# EAGLE design i2cstump-usbc (EAGLE 9.2.2)
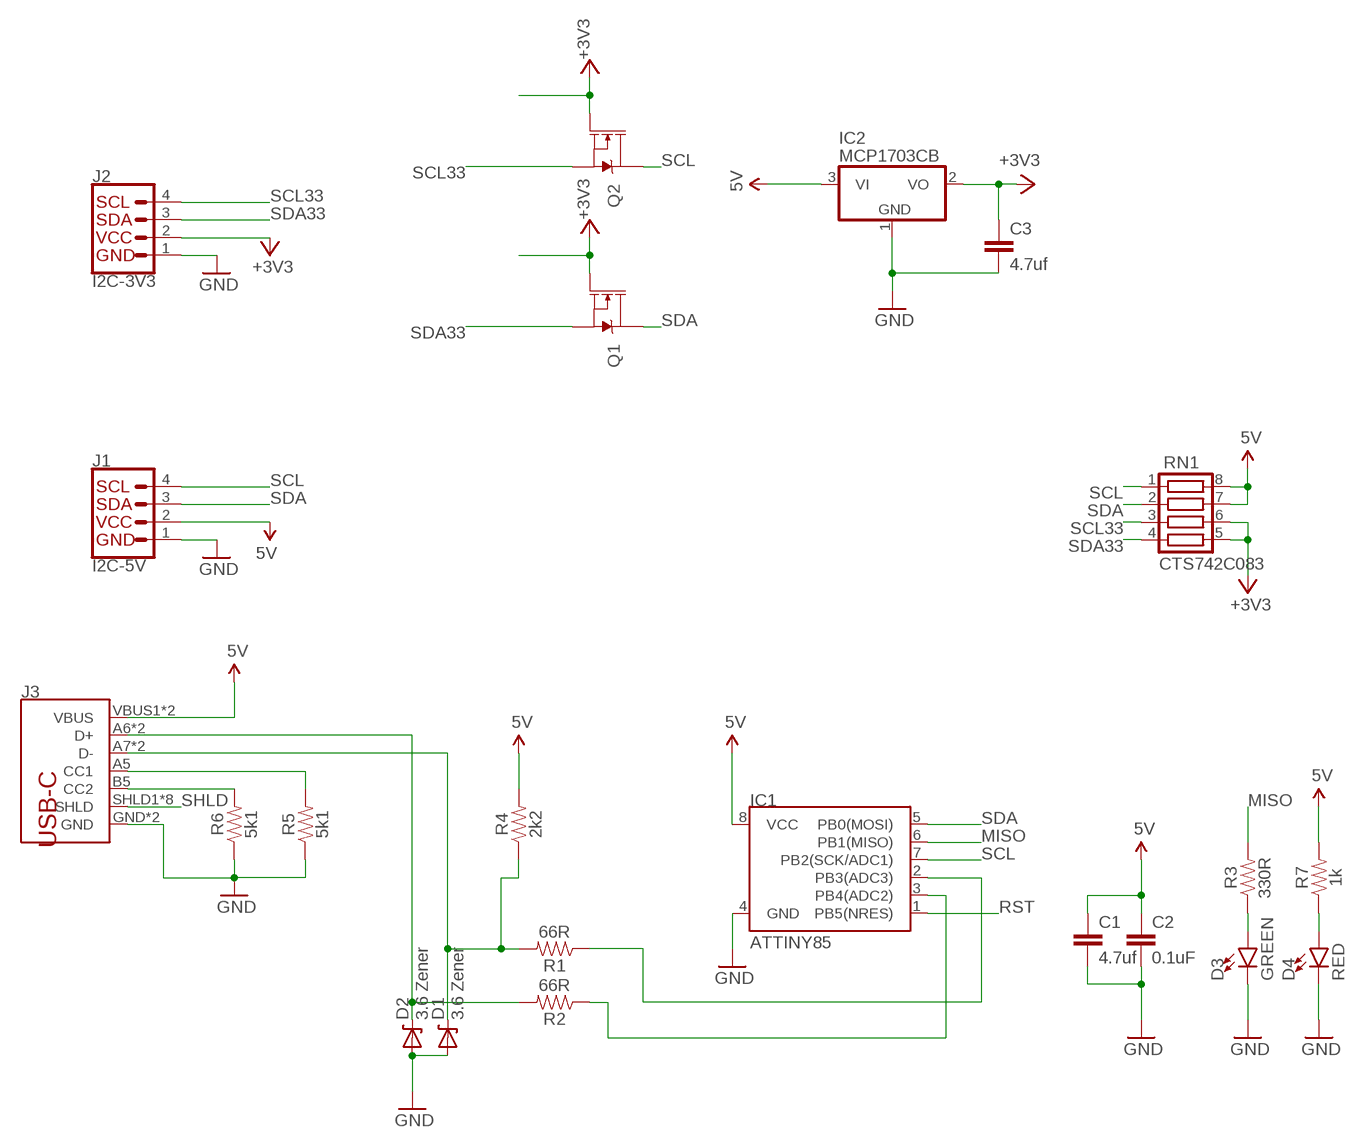
[diagram p0: schematic, sheet 1]

## Parts
C1  4.7uf  CAP0805  [0805]
C2  0.1uF  0.1UF-0603-25V-(+80/-20%)  [0603]
C3  4.7uf  CAP0805  [0805]
D1  3.6 Zener  DIODE-ZENER-BZT52  [SOD-323]
D2  3.6 Zener  DIODE-ZENER-BZT52  [SOD-323]
D3  GREEN  LED-GREEN0603  [LED-0603]
D4  RED  LED-GREEN0603  [LED-0603]
IC1  ATTINY85  ATTINY45  [SO08-EIAJ]
IC2  MCP1703CB  [SOT23]
J1  I2C-5V  QWIIC_CONNECTORJS-1MM  [1X04_1MM_RA]
J2  I2C-3V3  QWIIC_CONNECTORJS-1MM  [1X04_1MM_RA]
J3  USB_C16PIN  [USB-C-16P]
Q1  220mA/50V/3.5Ω  MOSFET-NCH-BSS138  [SOT23-3]
Q2  220mA/50V/3.5Ω  MOSFET-NCH-BSS138  [SOT23-3]
R1  66R  RESISTOR0603  [0603]
R2  66R  RESISTOR0603  [0603]
R3  330R  RESISTOR0603  [0603]
R4  2k2  RESISTOR0603  [0603]
R5  5k1  RESISTOR0603  [0603]
R6  5k1  RESISTOR0603  [0603]
R7  1k  RESISTOR0603  [0603]
RN1  CTS742C083  [CTS742C083]

## Nets
5V: C1.1 C2.1 IC1.8(VCC) IC2.3(VI) J1.2(VCC) J3.VBUS1(VBUS) J3.VBUS2(VBUS) R4.2 R7.2 RN1.7 RN1.8
+3V3: C3.1 IC2.2(VO) J2.2(VCC) Q1.1(G) Q2.1(G) RN1.5 RN1.6
GND: C1.2 C2.2 C3.2 D1.2(A) D2.2(A) D3.C D4.C IC1.4(GND) IC2.1(GND) J1.1(GND) J2.1(GND) J3.GND J3.GND2(GND) R5.1 R6.1
MISO: IC1.6(PB1(MISO)) R3.2
N$1: IC1.2(PB3(ADC3)) R1.1
N$2: D3.A R3.1
N$3: D4.A R7.1
N$4: J3.A5(CC1) R5.2
N$5: J3.B5(CC2) R6.2
N$6: IC1.3(PB4(ADC2)) R2.1
RST: IC1.1(PB5(NRES))
SCL: IC1.7(PB2(SCK/ADC1)) J1.4(SCL) Q2.3(D) RN1.1
SCL33: J2.4(SCL) Q2.2(S) RN1.3
SDA: IC1.5(PB0(MOSI)) J1.3(SDA) Q1.3(D) RN1.2
SDA33: J2.3(SDA) Q1.2(S) RN1.4
SHLD: J3.SHLD1(SHLD) J3.SHLD2(SHLD) J3.SHLD3(SHLD) J3.SHLD4(SHLD) J3.SHLD5(SHLD) J3.SHLD6(SHLD) J3.SHLD7(SHLD) J3.SHLD8(SHLD)
USB_M: D1.1(C) J3.A7(D-) J3.B7(D-) R1.2 R4.1
USB_P: D2.1(C) J3.A6(D+) J3.B6(D+) R2.2

## Library data of the parts
C1 C3 = SparkFun:CAP: Capacitor Standard 0603 ceramic capacitor, and 0.1" leaded capacitor.
C2 = SparkFun-Capacitors:0.1UF: 0.1µF ceramic capacitors A capacitor is a passive two-terminal electrical component used to store electrical energy temporarily in an electric field.; PROD_ID: CAP-00810
D1 D2 = SparkFun:DIODE-ZENER: Zener Diode Production Part - 8199 3.4V Zener Voltage
D3 = SparkFun-LED:LED-GREEN: Green SMD LED Used in manufacturing of various products at SparkFun Packages: 0603 - SMD 0603 package [Product Link] <http://www.futureelectronics.com/en/technologies/semiconductors/optoelectronics/leds/Pages/9894312-LTST-C190GKT.aspx?CrossPart=HSMG-C190&IM=0> LilyPad 1206 - SMD1206 LilyPad package [Product Link] <http://www.futureelectronics.com/en/Technologies/Product.aspx?ProductID=IN150NGHARVATEKCORPORATION2049943&IM=0> 1206 - SMD1206 package [Product Link] <http://www.futureelectronics.com/en/technologies/semiconductors/optoelectronics/leds/Pages/8315665-LTST-C150KGKT.aspx?IM=0> 1206 Bottom Mount -SMD 1206 Bottom Mount [Product Link] <http://www.digikey.com/product-detail/en/lite-on-inc/LTST-C230KGKT/160-1456-1-ND/386854> SparkFun Products: Pro Mini 328 -5V <https://www.sparkfun.com/products/821> RedBoard <https://www.sparkfun.com/products/12757> MP3 Trigger <https://www.sparkfun.com/products/13720> Makey Makey <https://www.sparkfun.com/products/11076>; PROD_ID: DIO-00821
D4 = SparkFun-LED:LED-GREEN: Green SMD LED Used in manufacturing of various products at SparkFun Packages: 0603 - SMD 0603 package [Product Link] <http://www.futureelectronics.com/en/technologies/semiconductors/optoelectronics/leds/Pages/9894312-LTST-C190GKT.aspx?CrossPart=HSMG-C190&IM=0> LilyPad 1206 - SMD1206 LilyPad package [Product Link] <http://www.futureelectronics.com/en/Technologies/Product.aspx?ProductID=IN150NGHARVATEKCORPORATION2049943&IM=0> 1206 - SMD1206 package [Product Link] <http://www.futureelectronics.com/en/technologies/semiconductors/optoelectronics/leds/Pages/8315665-LTST-C150KGKT.aspx?IM=0> 1206 Bottom Mount -SMD 1206 Bottom Mount [Product Link] <http://www.digikey.com/product-detail/en/lite-on-inc/LTST-C230KGKT/160-1456-1-ND/386854> SparkFun Products: Pro Mini 328 -5V <https://www.sparkfun.com/products/821> RedBoard <https://www.sparkfun.com/products/12757> MP3 Trigger <https://www.sparkfun.com/products/13720> Makey Makey <https://www.sparkfun.com/products/11076>; PROD_ID: DIO-00821; VALUE: GREEN
IC1 = SparkFun:ATTINY45: Atmel ATTiny45
IC2 = linear:MCP1703: 250 mA, 16V, Low Quiescent Current LDO Regulator Source: http://ww1.microchip.com/downloads/en/DeviceDoc/22049b.pdf
J1 J2 = SparkFun-Connectors:QWIIC_CONNECTOR: SparkFun I2C Standard Qwiic Connector An SMD 1mm pitch JST connector makes it easy and quick (get it? Qwiic?) to connect I2C devices to each other. The Qwiic system <http://www.sparkfun.com/qwiic> enables fast and solderless connection between popular platforms and various sensors and actuators. We carry 200mm <https://www.sparkfun.com/products/14204>, 100mm <https://www.sparkfun.com/products/14205>, 50mm <https://www.sparkfun.com/products/14206>, and breadboard friendly <https://www.sparkfun.com/products/14207> Qwiic cables. We also offer 10 pcs strips <https://www.sparkfun.com/products/14323> the SMD connectors.
J3 = USB-C:USB_C: USB Type C 16Pin Connector Super Speed pins not available on the 16-pin purely SMD connector so this part is best for USB 2.0 implementations. D1 and D2 are tied together enabling D+/- no matter which way the cable is plugged into the connector. The two channel configuration pins (CC1/2) are exposed. These are normally connected to ground via 5.1k resistors but can be reconfigured for high current/high power applications.; PROD_ID: CONN-14122
Q1 Q2 = SparkFun-DiscreteSemi:MOSFET-NCH: N-channel MOSFETs Voltage controlled devices that allow control of high current outputs. SparkFun Products: SparkFun OpenScale <https://www.sparkfun.com/products/13261> SparkFun Digital Sandbox <https://www.sparkfun.com/products/12651> SparkFun Monster Moto Shield <https://www.sparkfun.com/products/10182> SparkFun MOSFET Power Controller <https://www.sparkfun.com/products/11214>; PROD_ID: TRANS-00830
R1-R7 = SparkFun-Resistors:RESISTOR: Generic Resistor Package
RN1 = resistor-net:CTS742C083: Chip Resistor Array 4 Single Resistor Source: http://www.ctscorp.com/components/Datasheets/CTSChipArrayDs.pdf; OC_FARNELL: unknown; OC_NEWARK: unknown

## Board
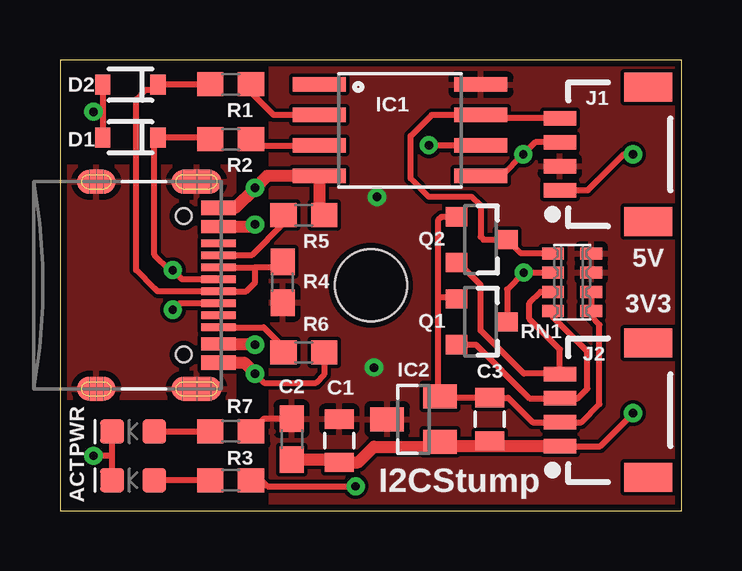
[diagram p1: board, top side]
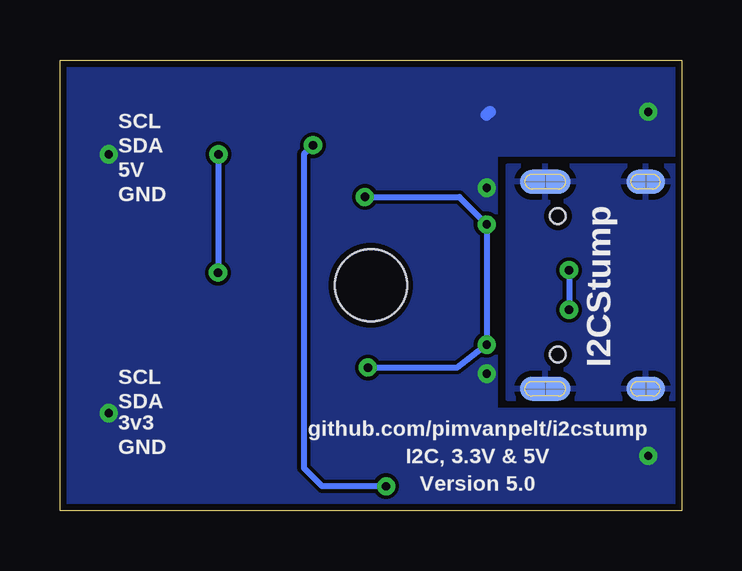
[diagram p2: board, bottom side, seen from below]

Size 25.91 x 18.8 mm. Coordinates in mm from the lower left corner, seen from the top.
Outline: 0,0 25.91,0 25.91,18.8 0,18.8 0,0
Copper layers (1*16): Top 0.035mm / dielectric 1.5mm / Bottom 0.035mm
Design rules "default *": minimum track width 6mil, minimum drill 0.35mm, track to track 6mil, track to pad 6mil, pad to pad 6mil, via to via 6mil, smd to smd 6mil, copper to edge 10mil, drill to drill 6mil, minimum pad ring 10mil, minimum via ring 8mil, stop-mask expansion 4mil, vias tented up to drill 20mil, thermal gap 10mil
Holes 3 mm at 12.95,9.4

### Footprints (pad centres in the part's own frame; a part is rotated, then mirrored left to right if it is on the bottom)
0805 = smd 0.8 x 1.2: 1 -0.9,0; 2 0.9,0
0603 = smd 1.1 x 1: 1 -0.85,0; 2 0.85,0
SOD-323 = smd 0.63 x 0.83: 1 -1.15,0; 2 1.15,0
LED-0603 = smd 1 x 1: A -0.877,0; C 0.877,0
SO08-EIAJ = smd 0.61 x 2.21: 1 -1.905,-3.378; 2 -0.635,-3.378; 3 0.635,-3.378; 4 1.905,-3.378; 5 1.905,3.353; 6 0.635,3.353; 7 -0.635,3.353; 8 -1.905,3.353
SOT23 = smd 1 x 1.4: 1 -0.95,-1.1; 2 0.95,-1.1; 3 0,1.1
1X04_1MM_RA = smd 0.6 x 1.35: 1 -1.5,0; 2 -0.5,0; 3 0.5,0; 4 1.5,0 | smd 1.2 x 2: NC1 2.8,-3.675; NC2 -2.8,-3.675
USB-C-16P = smd 0.3 x 1.45: A5 -1.25,0; A6 -0.25,0; A7 0.25,0; A8 1.25,0; B5 1.75,0; B6 0.75,0; B7 -0.75,0; B8 -1.75,0 | smd 0.6 x 1.45: GND -3.225,0; GND2 3.225,0 | smd 1 x 2.1: SHLD1 -4.32,-0.915; SHLD2 4.32,-0.915 | smd 1 x 2.1 bottom: SHLD3 -4.32,-0.915; SHLD4 4.32,-0.915 | smd 1 x 1.6: SHLD5 -4.32,-5.095; SHLD8 4.32,-5.095 | smd 1 x 1.6 bottom: SHLD6 -4.32,-5.095; SHLD7 4.32,-5.095 | smd 0.55 x 1.45: VBUS1 -2.45,0; VBUS2 2.45,0 | hole 0.65: -2.89,-1.445; 2.89,-1.445
SOT23-3 = smd 0.8 x 0.9: 1 -0.95,-1; 2 0.95,-1; 3 0,1.1
CTS742C083 = smd 0.5 x 0.9: 1 -1.2,-0.8; 2 -0.4,-0.8; 3 0.4,-0.8; 4 1.2,-0.8; 5 1.2,0.8; 6 0.4,0.8; 7 -0.4,0.8; 8 -1.2,0.8

### Placement (x,y rotation side)
C1  11.64,2.92 270 top
C2  9.65,2.98 270 top
C3  17.91,3.81 270 top
D1  2.93,17.76 180 top
D2  2.93,15.56 180 top
D3  3.05,1.27 180 top
D4  3.05,3.3 180 top
IC1  14.18,15.86 270 top
IC2  14.73,3.81 90 top
J1  20.83,14.86 90 top
J2  20.83,4.19 90 top
J3  6.6,9.4 270 top
Q1  17.53,7.87 270 top
Q2  17.53,11.3 270 top
R1  7.11,17.78 180 top
R2  7.11,15.49 180 top
R3  7.11,1.27 0 top
R4  9.27,9.53 270 top
R5  10.16,12.32 180 top
R6  10.16,6.6 180 top
R7  7.11,3.3 0 top
RN1  21.34,9.53 270 top

### Tracks (layer width: path | path; a pad name or v marks a point on that pad's centre or on a via)
5V  (via drill 0.35)
  Top 0.254: C2.1 8.49,3.83 R7.2
  Top 0.508: J3.VBUS1 8.04,11.85 v8.13,11.94 | J3.VBUS2 8.1,6.95 v8.13,6.92
  Bottom 0.254: v13.08,5.97 9.37,5.97 v8.13,6.92 v8.13,11.94 9.27,13.08 v13.21,13.08
  pour Top: 8.76,18.8 25.91,18.8 25.91,0 8.76,0
+3V3
  Top 0.254: Q2.1 15.89,12.25 15.75,12.11 15.75,8.89 | 15.75,8.89 15.75,4.76 | Q1.1 16.46,8.89 15.75,8.89 | RN1.6 RN1.5 22.14,8.09 22.48,7.75 22.48,4.45 21.73,3.69 J2.2 19.69,3.69 18.67,4.71 C3.1 15.88,4.71 IC2.2
  Top 0.508: IC2.2 15.75,4.76
GND  (via drill 0.35)
  Top 0.254: D2.2 D1.2 1.78,16.64 v1.4,16.64 | D3.C 2.17,2.29 | 2.17,2.29 D4.C | 2.17,2.29 v1.4,2.29 | J1.1 22,13.36 23.5,14.86 v23.88,14.86 | J2.1 22.5,2.69 v23.88,4.06 | R6.1 11.01,5.68 10.67,5.33 8.51,5.33 v8.13,5.71
  Top 0.508: J2.1 17.91,2.69 | 17.91,2.69 16,2.69 | 16,2.69 15.62,2.69 15.64,2.67 13.08,2.67 12.44,2.02 C1.2 11.52,2.13 C2.2 | C3.2 17.91,2.69 | IC2.1 16,2.69 | R5.1 10.8,12.53 IC1.4 8.62,13.96 v8.13,13.46 7.29,12.62 J3.GND | J3.GND2 7.67,6.17 v8.13,5.71
  Bottom 0.508: 8,16.64 8.13,16.51
  pour Bottom: 0,18.8 25.91,18.8 25.91,0 0,0 0,4.19 7.75,4.19 7.75,14.86 0,14.86
MISO  (via drill 0.35)
  Top 0.254: IC1.6 15.48,15.23 15.37,15.11 v15.37,15.24 | R3.2 8.38,1.27 8.64,1.02 v12.32,1.02
  Bottom 0.254: v15.37,15.24 15.75,14.86 15.75,1.78 14.99,1.02 v12.32,1.02
N$1
  Top 0.254: IC1.2 8.9,16.5 7.96,17.44 R1.1
N$2
  Top 0.254: R3.1 D3.A
N$3
  Top 0.254: D4.A R7.1
N$4
  Top 0.254: J3.A5 6.62,10.67 8,10.67 9.31,11.98 R5.2
N$5
  Top 0.254: R6.2 9.4,6.6 9.46,6.67 8.48,7.65 J3.B5
N$6
  Top 0.254: R2.1 8.23,15.23 IC1.3
SCL
  Top 0.254: RN1.1 19.2,10.72 Q2.3 17.65,11.3 17.53,11.43 17.53,12.71 17.16,13.09 15.37,13.09 14.61,13.85 14.61,15.62 15.48,16.5 IC1.7 17.67,16.36 J1.4
SCL33
  Top 0.254: RN1.3 20.02,9.12 19.56,8.66 19.56,8 20.83,6.73 J2.4 20.8,5.71 19.32,5.71 17.53,7.51 17.53,9.41 16.59,10.35 Q2.2
SDA  (via drill 0.35)
  Top 0.254: J1.3 19.8,15.36 v19.3,14.86 18.4,13.96 IC1.5 | Q1.3 18.63,9.23 v19.32,9.93 RN1.2
  Bottom 0.254: v19.3,14.86 19.3,9.91 v19.32,9.93
SDA33
  Top 0.254: RN1.4 20.54,8.07 21.97,6.64 21.97,5.08 21.58,4.69 J2.3 19.56,4.69 17.32,6.92 Q1.2
SHLD
  pour Top: 7.24,14.35 7.24,4.7 0,4.7 0,14.35
  pour Bottom: 0,14.35 7.24,14.35 7.24,4.7 0,4.7
USB_M
  Top 0.254: R1.2 6.24,17.76 D1.1 3.85,17.53 3.56,17.53 3.17,17.14 3.17,10.03 3.94,9.27 3.94,9.28 4.07,9.15 J3.A7 7.75,9.15 8.13,9.53 8.13,10.15 | J3.B7 8.13,10.15 | R4.1 9.04,10.15 8.13,10.15
USB_P  (via drill 0.35)
  Top 0.254: R2.2 6.19,15.56 D2.1 3.94,15.42 3.94,10.67 4.57,10.03 v4.7,10.03 5.08,9.65 J3.A6 | J3.B6 6.59,8.64 4.95,8.64 v4.7,8.38
  Bottom 0.254: v4.7,10.03 v4.7,8.38

### Text on the board
tPlace: D2 | IC1 | D1 | 5V | 3V3 | RN1 | C1 | PWR | I2CStump | ACT
bPlace: SCL | SDA | 5V | GND | SCL | SDA | 3v3 | GND | github.com/pimvanpelt/i2cstump / I2C, 3.3V & 5V / Version 5.0
bNames: I2CStump